# EAGLE design UTS_RaceCounter (EAGLE 9.4.1)
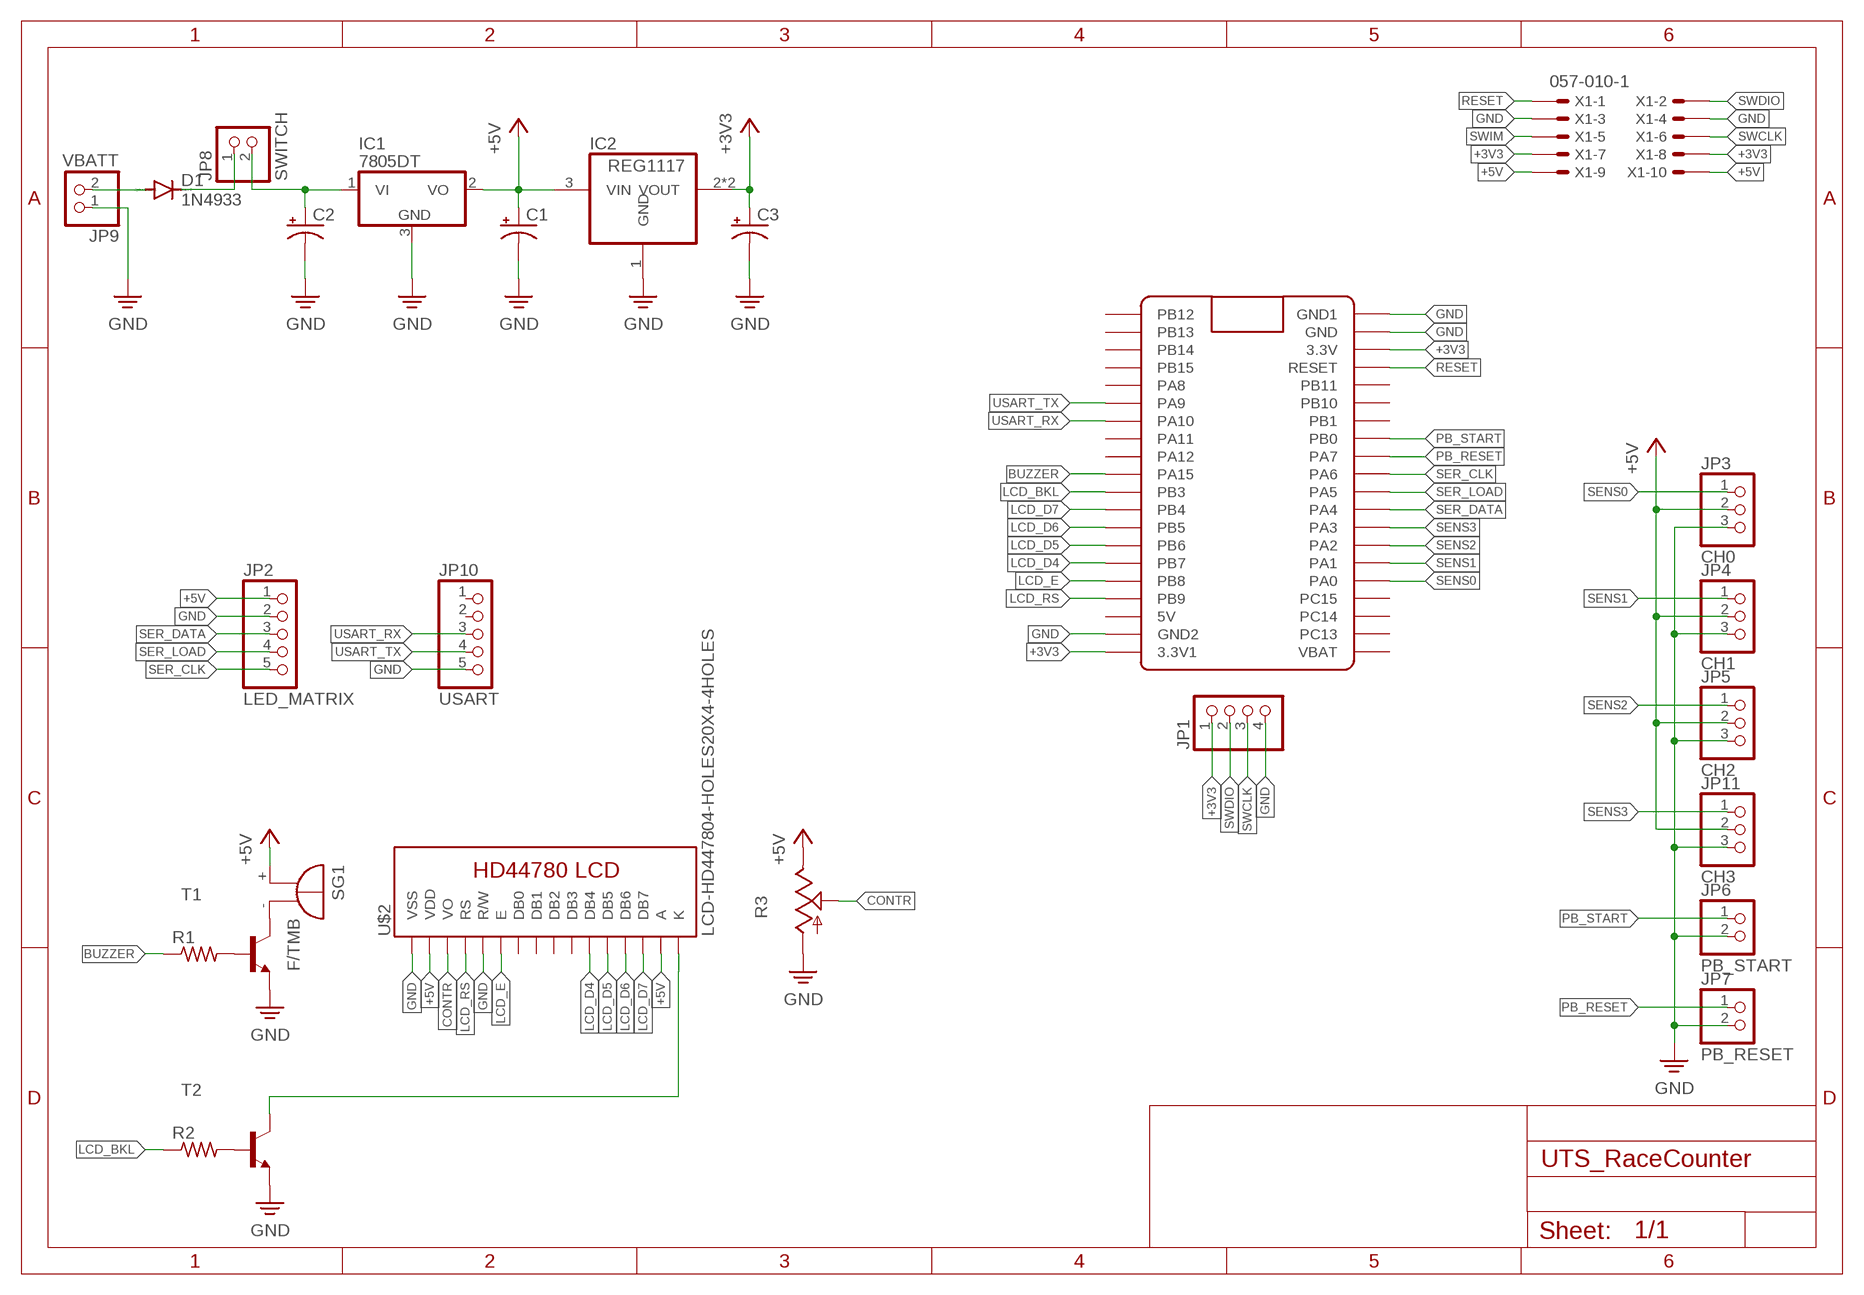
[diagram p0: schematic, sheet 1]

## Parts
C1  CPOL-USE2.5-6  [E2,5-6]
C2  CPOL-USE2.5-6  [E2,5-6]
C3  CPOL-USE2.5-6  [E2,5-6]
D1  1N4933  [DO41-10]
IC1  7805DT  [TO252]
IC2  REG1117  [SOT223]
JP1  PINHD-1X4  [1X04]
JP2  LED_MATRIX  PINHD-1X5  [1X05]
JP3  CH0  PINHD-1X3  [1X03]
JP4  CH1  PINHD-1X3  [1X03]
JP5  CH2  PINHD-1X3  [1X03]
JP6  PB_START  PINHD-1X2  [1X02]
JP7  PB_RESET  PINHD-1X2  [1X02]
JP8  SWITCH  PINHD-1X2  [1X02]
JP9  VBATT  PINHD-1X2  [1X02]
JP10  USART  PINHD-1X5  [1X05]
JP11  CH3  PINHD-1X3  [1X03]
R1  R-US_0204/7  [0204/7]
R2  R-US_0204/7  [0204/7]
R3  TRIM_US-CA6V  [CA6V]
SG1  F/TMB  [F/TMB]
T1  BC167-NPN-TO92-ECB  [TO92-ECB]
T2  BC167-NPN-TO92-ECB  [TO92-ECB]
U$1  BLUE_PILL  [BLUE_PILL]
U$2  LCD-HD447804-HOLES20X4-4HOLES  [LCD-20X4-4HOLES]
X1  057-010-1  [057-010-1]

## Nets
+3V3: C3.+ IC2.2(VOUT) IC2.4(VOUT) JP1.1 U$1.P$20(3.3V1) U$1.P$23(3.3V) X1.7 X1.8
+5V: C1.+ IC1.2(VO) IC2.3(VIN) JP2.1 JP3.2 JP4.2 JP5.2 JP11.2 R3.E SG1.+ U$2.P$2(VDD) U$2.P$15(A) X1.9 X1.10
BUZZER: R1.1 U$1.P$10(PA15)
CONTR: R3.S U$2.P$3(VO)
GND: C1.- C2.- C3.- IC1.3(GND) IC2.1(GND) JP1.4 JP2.2 JP3.3 JP4.3 JP5.3 JP6.2 JP7.2 JP9.1 JP10.5 JP11.3 R3.A T1.E T2.E U$1.P$19(GND2) U$1.P$21(GND1) U$1.P$22(GND) U$2.P$1(VSS) U$2.P$5(R/W) X1.3 X1.4
LCD_BKL: R2.1 U$1.P$11(PB3)
LCD_D4: U$1.P$15(PB7) U$2.P$11(DB4)
LCD_D5: U$1.P$14(PB6) U$2.P$12(DB5)
LCD_D6: U$1.P$13(PB5) U$2.P$13(DB6)
LCD_D7: U$1.P$12(PB4) U$2.P$14(DB7)
LCD_E: U$1.P$16(PB8) U$2.P$6(E)
LCD_RS: U$1.P$17(PB9) U$2.P$4(RS)
N$1: SG1.- T1.C
N$2: R1.2 T1.B
N$3: R2.2 T2.B
N$5: C2.+ IC1.1(VI) JP8.2
N$7: D1.C JP8.1
N$8: D1.A JP9.2
N$18: T2.C U$2.P$16(K)
PB_RESET: JP7.1 U$1.P$29(PA7)
PB_START: JP6.1 U$1.P$28(PB0)
RESET: U$1.P$24(RESET) X1.1
SENS0: JP3.1 U$1.P$36(PA0)
SENS1: JP4.1 U$1.P$35(PA1)
SENS2: JP5.1 U$1.P$34(PA2)
SENS3: JP11.1 U$1.P$33(PA3)
SER_CLK: JP2.5 U$1.P$30(PA6)
SER_DATA: JP2.3 U$1.P$32(PA4)
SER_LOAD: JP2.4 U$1.P$31(PA5)
SWCLK: JP1.3 X1.6
SWDIO: JP1.2 X1.2
SWIM: X1.5
USART_RX: JP10.3 U$1.P$7(PA10)
USART_TX: JP10.4 U$1.P$6(PA9)
Unconnected: JP10.1 JP10.2 U$1.P$1(PB12) U$1.P$2(PB13) U$1.P$3(PB14) U$1.P$4(PB15) U$1.P$5(PA8) U$1.P$8(PA11) U$1.P$9(PA12) U$1.P$18(5V) U$1.P$25(PB11) U$1.P$26(PB10) U$1.P$27(PB1) U$1.P$37(PC15) U$1.P$38(PC14) U$1.P$39(PC13) U$1.P$40(VBAT) U$2.P$7(DB0) U$2.P$8(DB1) U$2.P$9(DB2) U$2.P$10(DB3)

## Library data of the parts
C1-C3 = rcl:CPOL-US: POLARIZED CAPACITOR, American symbol; SPICEPREFIX: C
D1 = diode:1N4933: DIODE fast recovery rectifier, 1A
IC1 = linear:78*: Positive VOLTAGE REGULATOR Source: http://cache.national.com/ds/LM/LM78L05.pdf http://www.fairchildsemi.com/ds/LM/LM7805.pdf
IC2 = burr-brown:REG1117: 800mA and 1A Low Dropout (LDO) Positive Regulator 1.8V, 2.5V, 2.85V, 3.3V, 5V, and Adj; MPN: REG1117; OC_FARNELL: 1097566; OC_NEWARK: 14P6981
JP1 = pinhead:PINHD-1X4: PIN HEADER
JP2 JP10 = pinhead:PINHD-1X5: PIN HEADER
JP3-JP5 JP11 = pinhead:PINHD-1X3: PIN HEADER
JP6-JP9 = pinhead:PINHD-1X2: PIN HEADER
R1 R2 = rcl:R-US_: RESISTOR, American symbol; SPICEPREFIX: R
R3 = pot:TRIM_US-: POTENTIOMETER
SG1 = buzzer:F/TMB: BUZZER Source: Buerklin; OC_FARNELL: unknown; OC_NEWARK: unknown
T1 T2 = transistor:*-NPN-: NPN Transistror BF959 corrected 2008.03.06
U$1 = BluePill:BLUE_PILL
U$2 = HD44780LCD:LCD-HD44780
X1 = con-panduit:057-010-: CONNECTOR 10-pin series 057 contact pc board low profile headers; OC_FARNELL: unknown; OC_NEWARK: unknown

## Board
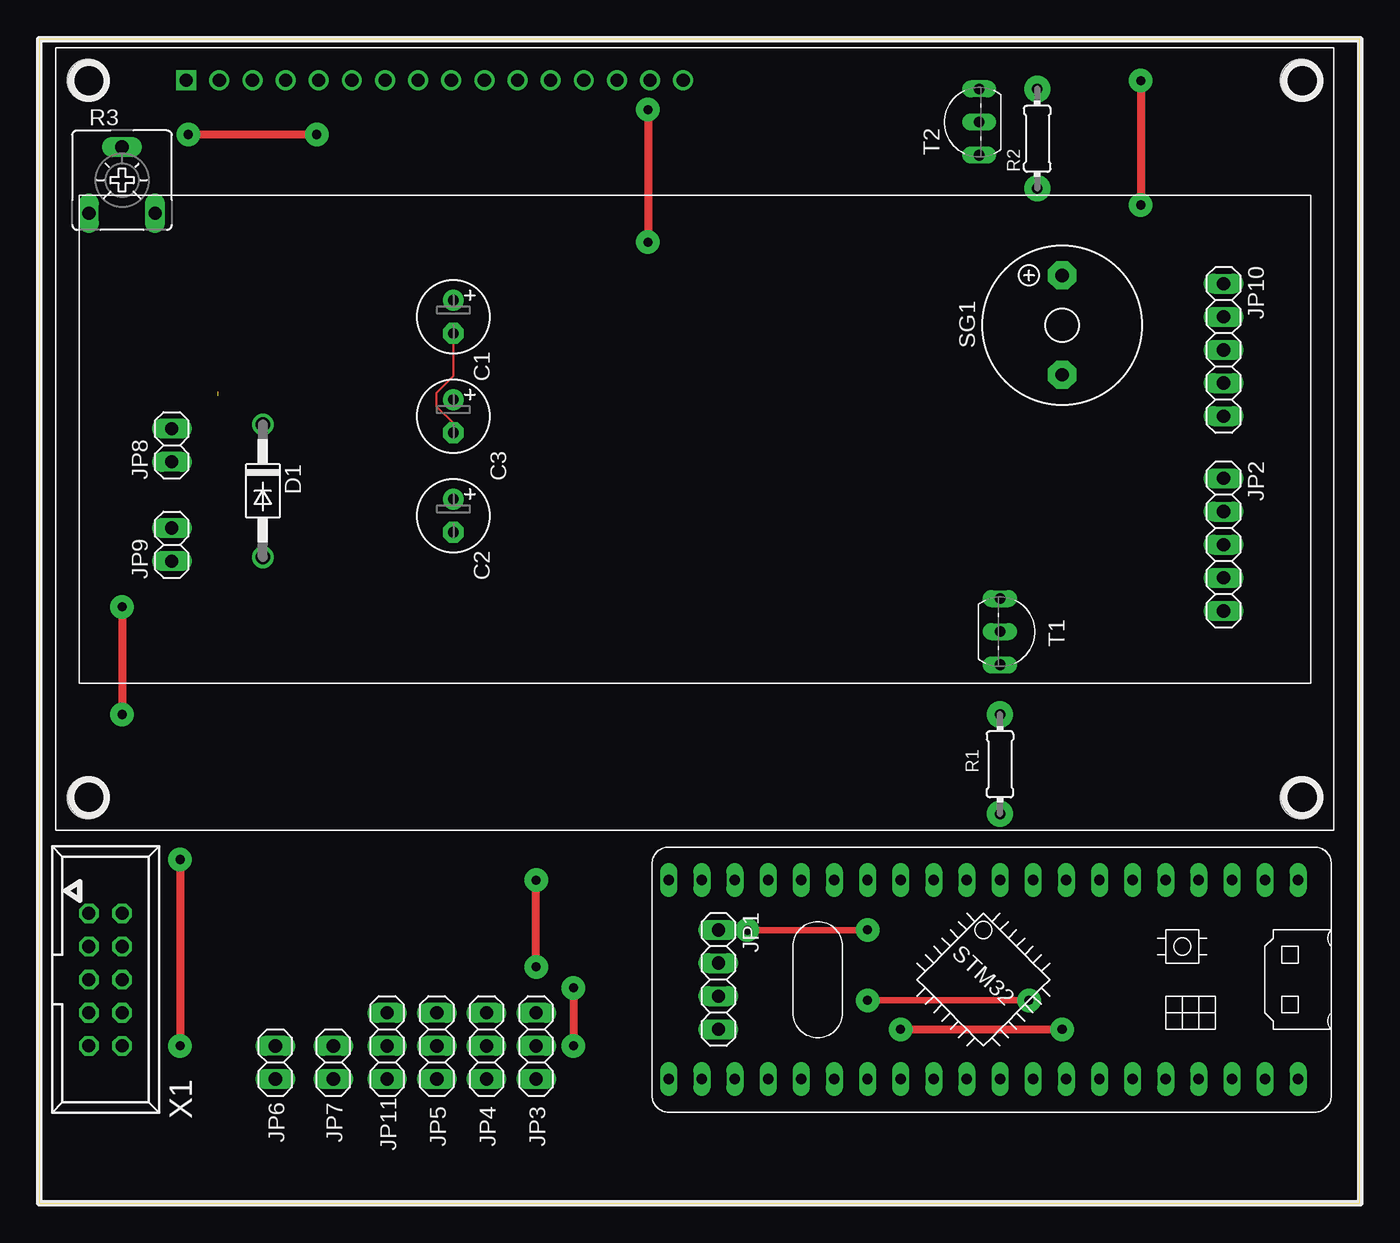
[diagram p1: board, top side]
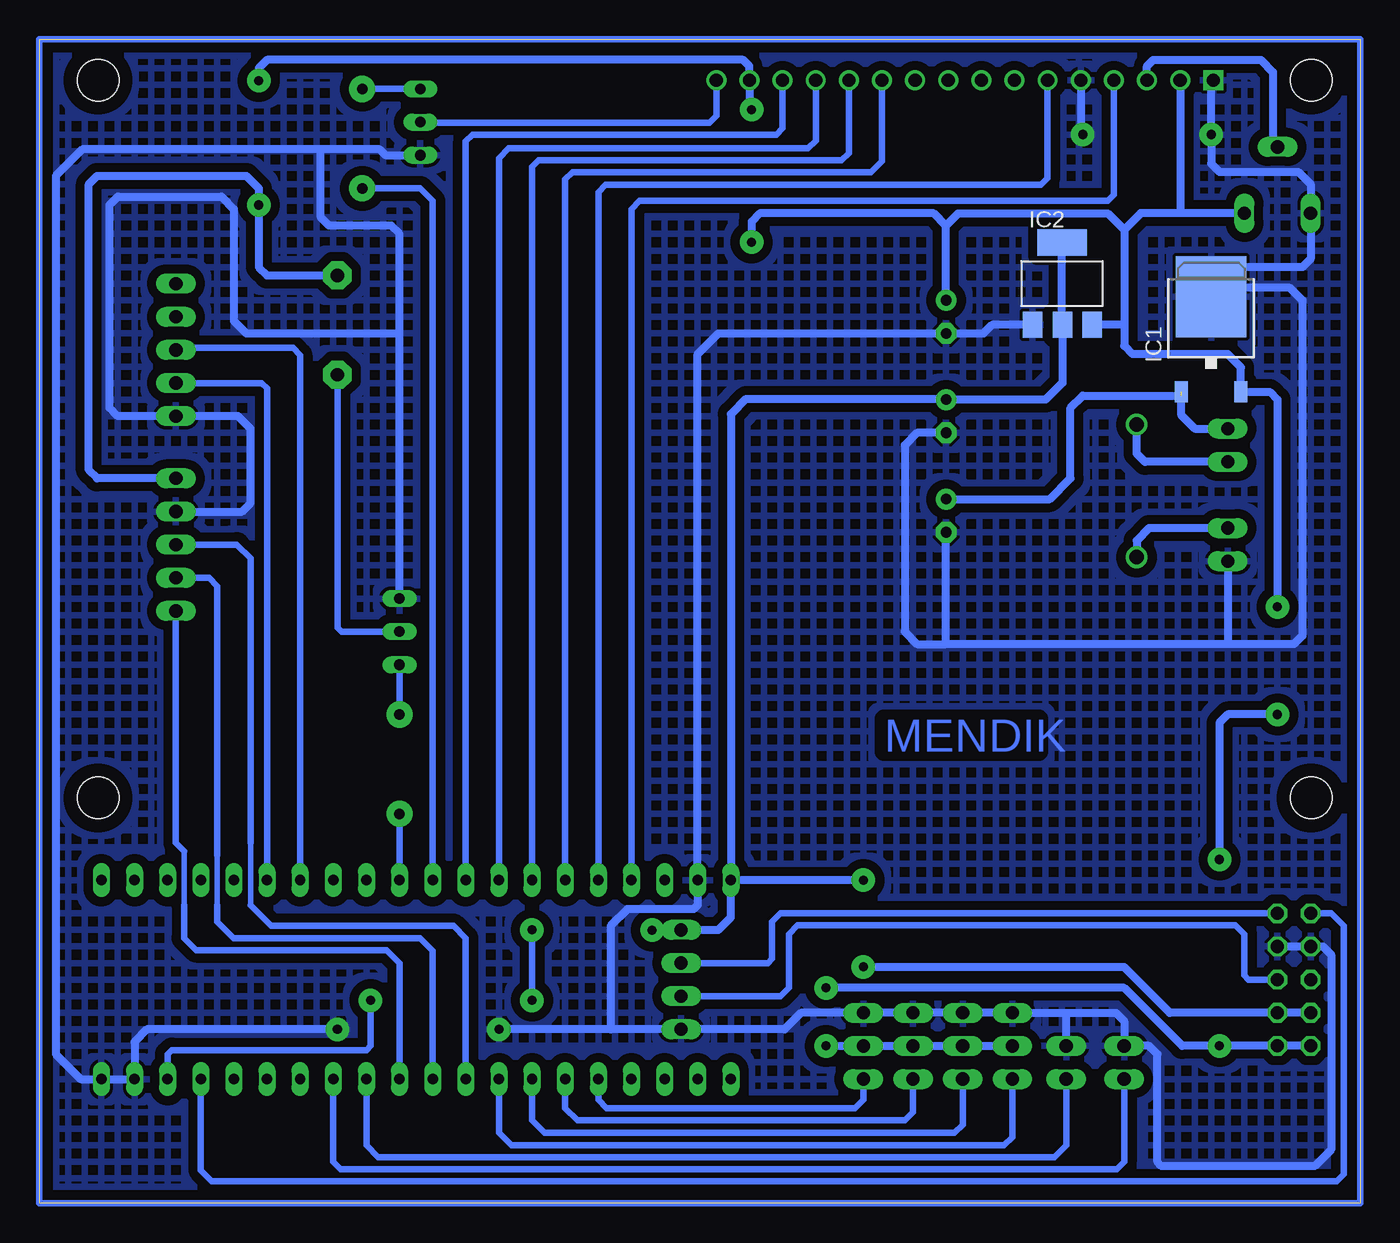
[diagram p2: board, bottom side, seen from below]

Size 101.26 x 89.2 mm. Coordinates in mm from the lower left corner, seen from the top.
Outline: 0,0 101.26,0 101.26,89.2 0,89.2 0,0
Copper layers (1*16): Top 0.035mm / dielectric 1.5mm / Bottom 0.035mm
Design rules "default *": minimum track width 6mil, minimum drill 0.35mm, track to track 16mil, track to pad 16mil, pad to pad 16mil, via to via 16mil, smd to smd 16mil, copper to edge 40mil, drill to drill 6mil, minimum pad ring 10mil, minimum via ring 8mil, stop-mask expansion 4mil, vias tented up to drill 0mil, thermal gap 10mil

### Footprints (pad centres in the part's own frame; a part is rotated, then mirrored left to right if it is on the bottom)
E2,5-6 = drill 0.813 pad 1.6: + -1.27,0 | drill 0.813 pad 1.6 octagon: - 1.27,0
DO41-10 = drill 1.118: A 5.08,0; C -5.08,0
TO252 = smd 1 x 1.6: 1 -2.28,-4.8; 2 2.28,-4.8 | smd 5.4 x 6.2: 3 0,2.5
SOT223 = smd 1.499 x 2.007: 1 -2.261,-3.15; 2 0.025,-3.15; 3 2.311,-3.15 | smd 3.81 x 2.007: 4 0,3.15
1X04 = drill 1.016 long: 1 -3.81,0; 2 -1.27,0; 3 1.27,0; 4 3.81,0
1X05 = drill 1.016 long: 1 -5.08,0; 2 -2.54,0; 3 0,0; 4 2.54,0; 5 5.08,0
1X03 = drill 1.016 long: 1 -2.54,0; 2 0,0; 3 2.54,0
1X02 = drill 1.016 long: 1 -1.27,0; 2 1.27,0
0204/7 = drill 0.813 pad 2: 1 -3.81,0; 2 3.81,0
CA6V = drill 1.016 long: A -2.54,-2.54; E 2.54,-2.54; S 0,2.54
F/TMB = drill 1.016 pad 2.159 octagon: + 3.81,0; - -3.81,0
TO92-ECB = drill 0.813 long: B 2.54,0; C 0,0; E -2.54,0
BLUE_PILL = drill 0.8 long: P$1 -7.62,15.24; P$2 -7.62,12.7; P$3 -7.62,10.16; P$4 -7.62,7.62; P$5 -7.62,5.08; P$6 -7.62,2.54; P$7 -7.62,0; P$8 -7.62,-2.54; P$9 -7.62,-5.08; P$10 -7.62,-7.62; P$11 -7.62,-10.16; P$12 -7.62,-12.7; P$13 -7.62,-15.24; P$14 -7.62,-17.78; P$15 -7.62,-20.32; P$16 -7.62,-22.86; P$17 -7.62,-25.4; P$18 -7.62,-27.94; P$19 -7.62,-30.48; P$20 -7.62,-33.02; P$21 7.62,15.24; P$22 7.62,12.7; P$23 7.62,10.16; P$24 7.62,7.62; P$25 7.62,5.08; P$26 7.62,2.54; P$27 7.62,0; P$28 7.62,-2.54; P$29 7.62,-5.08; P$30 7.62,-7.62; P$31 7.62,-10.16; P$32 7.62,-12.7; P$33 7.62,-15.24; P$34 7.62,-17.78; P$35 7.62,-20.32; P$36 7.62,-22.86; P$37 7.62,-25.4; P$38 7.62,-27.94; P$39 7.62,-30.48; P$40 7.62,-33.02
LCD-20X4-4HOLES = drill 1.016 square: P$1 10,57.5 | drill 1.016: P$2 12.54,57.5; P$3 15.08,57.5; P$4 17.62,57.5; P$5 20.16,57.5; P$6 22.7,57.5; P$7 25.24,57.5; P$8 27.78,57.5; P$9 30.32,57.5; P$10 32.86,57.5; P$11 35.4,57.5; P$12 37.94,57.5; P$13 40.48,57.5; P$14 43.02,57.5; P$15 45.56,57.5; P$16 48.1,57.5 | hole 3.2: 2.5,2.5; 2.5,57.5; 95.5,57.5; 95.5,2.5
057-010-1 = drill 1 octagon: 1 -5.08,-1.27; 2 -5.08,1.27; 3 -2.54,-1.27; 4 -2.54,1.27; 5 0,-1.27; 6 0,1.27; 7 2.54,-1.27; 8 2.54,1.27; 9 5.08,-1.27; 10 5.08,1.27

### Placement (x,y rotation side)
C1  31.75,67.94 270 top
C2  31.75,52.7 270 top
C3  31.75,60.33 270 top
D1  17.14,54.61 270 top
IC1  11.43,66.99 0 bottom
IC2  22.86,70.48 0 bottom
JP1  52.07,17.15 270 top
JP2  90.81,50.48 270 top
JP3  38.1,12.06 90 top
JP4  34.29,12.06 90 top
JP5  30.48,12.06 90 top
JP6  18.1,10.79 90 top
JP7  22.54,10.79 90 top
JP8  10.16,58.1 90 top
JP9  10.16,50.48 90 top
JP10  90.81,65.41 270 top
JP11  26.67,12.06 90 top
R1  73.66,33.66 90 top
R2  76.52,81.6 90 top
R3  6.35,78.42 0 top
SG1  78.42,67.31 90 top
T1  73.66,43.81 270 top
T2  72.07,82.87 90 top
U$1  81.28,17.15 270 top
U$2  1.27,28.57 0 top
X1  5.08,17.15 270 top

### Tracks (layer width: path | path; a pad name or v marks a point on that pad's centre or on a via)
+3V3  (via drill 0.7 pad 1.8)
  Top 0.508: v75.88,15.56 v63.5,15.56 | v54.29,20.93 63.48,20.93 v63.5,20.95
  Top 0.61: v38.1,18.12 v38.1,24.77
  Bottom 0.508: U$1.P$23 91.44,11.43 91.12,11.75 76.2,11.75 75.88,12.06 v75.88,15.56 | JP1.1 54.27,20.95 v54.29,20.93 | v63.5,20.95 v63.5,15.56
  Bottom 0.61: X1.7 X1.8 14.61,14.6 18.1,18.1 38.08,18.1 v38.1,18.12 | IC2.4 22.86,67.36 IC2.2 22.84,62.89 24.13,61.59 C3.+ 31.81,61.66 47.09,61.66 48.26,60.49 U$1.P$20 | JP1.1 49.21,20.95 48.26,21.91 U$1.P$20 | v38.1,24.77 U$1.P$20
+5V  (via drill 0.7 pad 1.8)
  Top 0.61: v46.67,83.82 v46.67,73.66 | v40.96,16.51 v40.96,12.06 | v84.45,86.04 v84.45,76.52 | v6.35,45.72 v6.35,37.46 | v10.79,26.35 v10.79,12.06
  Bottom 0.61: JP11.2 JP5.2 JP4.2 JP3.2 v40.96,12.06 | X1.9 X1.10 v10.79,12.06 13.65,12.06 18.1,16.51 v40.96,16.51 | 18.1,67.33 IC2.3 | 10.16,65.09 9.15,64.08 IC1.2 6.95,62.19 6.35,61.59 v6.35,45.72 | 10.16,65.09 10.19,65.11 | C1.+ 31.75,74.93 | 31.75,74.93 30.81,75.87 19.36,75.87 18.1,74.61 | 18.1,74.61 18.1,67.33 | 10.16,65.09 17.46,65.09 18.1,65.72 18.1,67.33 | R3.E 13.65,75.88 | 13.65,75.88 16.83,75.88 18.1,74.61 | 13.65,75.88 13.81,76.04 U$2.P$2 | v46.67,83.82 46.83,83.98 U$2.P$15 46.83,87.15 47.31,87.63 83.82,87.63 84.45,87 v84.45,86.04 | 31.75,74.93 32.69,75.87 46.05,75.87 46.67,75.25 v46.67,73.66 | JP2.1 96.84,55.56 97.47,56.2 97.47,78.11 96.84,78.74 85.41,78.74 84.45,77.79 v84.45,76.52 84.45,71.75 83.82,71.12 SG1.+ | v6.35,37.46 10.16,37.46 10.79,36.83 v10.79,26.35
BUZZER
  Bottom 0.508: U$1.P$10 R1.1
CONTR
  Bottom 0.61: U$2.P$3 16.35,87.16 15.88,87.63 7.62,87.63 6.69,86.7 6.69,81.3 R3.S
GND  (via drill 0.7 pad 1.8)
  Top 0.152: C3.- 31.75,59.78 30.47,61.06 30.47,62.13 31.75,63.41 C1.-
  Top 0.61: v21.27,81.91 v11.43,81.91 | v66.04,13.33 v78.42,13.33
  Bottom 0.61: 22.54,14.6 JP11.3 JP5.3 JP4.3 JP3.3 42.86,14.6 44.13,13.33 JP1.4 57.47,13.33 | JP7.2 22.54,14.6 | X1.4 X1.3 2.86,19.69 2.23,19.06 2.23,4.12 3.49,2.86 15.24,2.86 15.56,3.18 15.56,11.43 16.19,12.06 JP6.2 18.1,13.97 18.73,14.6 22.54,14.6 | JP9.1 10.16,42.86 | 10.16,42.86 5.08,42.86 4.45,43.5 4.45,69.22 5.4,70.17 10.76,70.17 IC1.3 | 10.16,42.86 31.75,42.86 | 31.75,42.86 C2.- | IC1.3 11.43,71.75 4.45,71.75 3.81,72.39 R3.A 3.81,78.11 4.76,79.06 10.79,79.06 11.43,79.69 v11.43,81.91 11.43,85.91 U$2.P$1 | IC2.1 28.23,67.33 28.89,66.67 C1.- 49.21,66.67 50.8,65.09 U$1.P$19 50.8,22.86 51.12,22.54 56.2,22.54 57.47,21.27 57.47,13.33 | C3.- 33.97,59.05 34.92,58.1 34.92,43.81 33.97,42.86 31.75,42.86 | IC1.3 10.2,68.26 | U$2.P$5 21.43,82.07 v21.27,81.91 | JP2.2 85.72,53.02 85.09,53.66 85.09,59.37 86.04,60.33 JP10.5 95.25,60.33 95.89,60.96 95.89,76.52 95.25,77.15 87.31,77.15 86.36,76.2 86.36,67.63 85.41,66.67 73.66,66.67 | T2.E 74.73,80.33 75.17,80.77 79.69,80.77 | T1.E 73.66,66.67 | 73.66,66.67 73.66,74.3 74.3,74.93 79.06,74.93 79.69,75.56 79.69,80.77 | 79.69,80.77 97.98,80.77 100.01,78.74 100.01,11.43 98.11,9.53 U$1.P$21 U$1.P$22 93.98,12.38 93.03,13.33 v78.42,13.33 | 57.47,13.33 v66.04,13.33
  pour Bottom (isolate 0.7, hatched): 0,89.22 101.28,89.22 101.28,0 0,0
LCD_BKL
  Bottom 0.508: R2.1 72.07,77.79 71.12,76.83 U$1.P$11
LCD_D4
  Bottom 0.508: U$2.P$11 36.67,79.85 37.5,79.02 60.41,79.02 60.96,78.47 U$1.P$15
LCD_D5
  Bottom 0.508: U$2.P$12 39.21,80.49 39.76,79.93 63.01,79.93 63.5,79.44 U$1.P$14
LCD_D6
  Bottom 0.508: U$2.P$13 41.75,81.44 42.34,80.85 65.29,80.85 66.04,80.1 U$1.P$13
LCD_D7
  Bottom 0.508: U$1.P$12 68.58,81.4 68.06,81.91 44.77,81.91 44.29,82.39 U$2.P$14
LCD_E
  Bottom 0.508: U$2.P$6 23.97,78.58 24.49,78.07 57.85,78.07 58.42,77.49 U$1.P$16
LCD_RS
  Bottom 0.508: U$2.P$4 18.89,77.31 19.37,76.83 55.24,76.83 55.88,76.2 U$1.P$17
N$1
  Bottom 0.508: SG1.- 78.42,44.13 78.11,43.81 T1.C
N$2
  Bottom 0.508: T1.B R1.2
N$3
  Bottom 0.508: R2.2 T2.B
N$4
  Bottom 0.508: 0,89.22 101.28,89.22 101.28,0 0,0 0,89.22
N$5  (1 unrouted)
  Bottom 0.61: JP8.2 12.7,59.37 13.71,60.38 13.71,61.91 21.27,61.91 22.23,60.96 22.23,55.56 23.81,53.97 C2.+
N$6  (via drill 0.7 pad 1.8)
  other vias: 3.81,86.04
N$7
  Bottom 0.61: JP8.1 16.51,56.83 17.14,57.47 D1.C
N$8
  Bottom 0.61: JP9.2 16.19,51.75 17.14,50.8 D1.A
N$9  (via drill 0.7 pad 1.8)
  other vias: 3.81,31.11
N$10  (via drill 0.7 pad 1.8)
  other vias: 96.84,31.11
N$11  (via drill 0.7 pad 1.8)
  other vias: 96.84,86.04
N$18
  Bottom 0.508: U$2.P$16 49.37,83.34 49.89,82.83 72.03,82.83 T2.C
PB_RESET
  Bottom 0.508: JP7.1 22.54,4.45 23.46,3.53 75.29,3.53 76.2,4.45 U$1.P$29
PB_START
  Bottom 0.508: JP6.1 18.1,3.18 18.66,2.62 78.18,2.62 78.74,3.18 U$1.P$28
RESET
  Bottom 0.508: U$1.P$24 88.9,2.54 88.06,1.7 1.79,1.7 1.27,2.22 1.27,21.27 2.22,22.23 X1.1
SENS0
  Bottom 0.508: JP3.1 38.1,7.94 38.73,7.3 57.78,7.3 58.42,7.94 U$1.P$36
SENS1
  Bottom 0.508: JP4.1 34.29,6.99 34.92,6.35 60.01,6.35 60.96,7.3 U$1.P$35
SENS2
  Bottom 0.508: JP5.1 30.48,6.03 31.11,5.4 62.55,5.4 63.5,6.35 U$1.P$34
SENS3
  Bottom 0.508: JP11.1 26.67,5.08 27.3,4.45 65.09,4.45 66.04,5.4 U$1.P$33
SER_CLK
  Bottom 0.406: 90.17,26.99 90.17,22.86
  Bottom 0.508: JP2.5 90.81,27.62 90.17,26.99 | 90.17,22.86 90.17,20.32 89.26,19.41 74.65,19.41 73.66,18.41 U$1.P$30
SER_DATA
  Bottom 0.406: 85.09,27.62 85.09,22.86
  Bottom 0.508: JP2.3 86.13,50.48 85.09,49.45 85.09,27.62 | 85.09,22.86 83.5,21.27 69.53,21.27 68.58,20.32 U$1.P$32
SER_LOAD
  Bottom 0.406: 87.63,26.67 87.63,22.86
  Bottom 0.508: JP2.4 88.27,47.94 87.63,47.31 87.63,26.67 | U$1.P$31 71.12,19.37 72.07,20.32 86.36,20.32 87.63,21.59 87.63,22.86
SWCLK
  Bottom 0.508: JP1.3 44.45,15.88 43.81,16.51 43.81,20.64 43.14,21.31 9.56,21.31 8.89,20.64 8.89,17.46 8.57,17.15 X1.6
SWDIO
  Bottom 0.508: JP1.2 45.4,18.41 45.09,18.73 45.09,21.59 44.45,22.23 X1.2
USART_RX
  Bottom 0.508: JP10.3 90.65,65.56 81.83,65.56 81.28,65 U$1.P$7
USART_TX
  Bottom 0.508: JP10.4 84.22,62.86 83.82,62.46 U$1.P$6

### Text on the board
Bottom: MENDIK